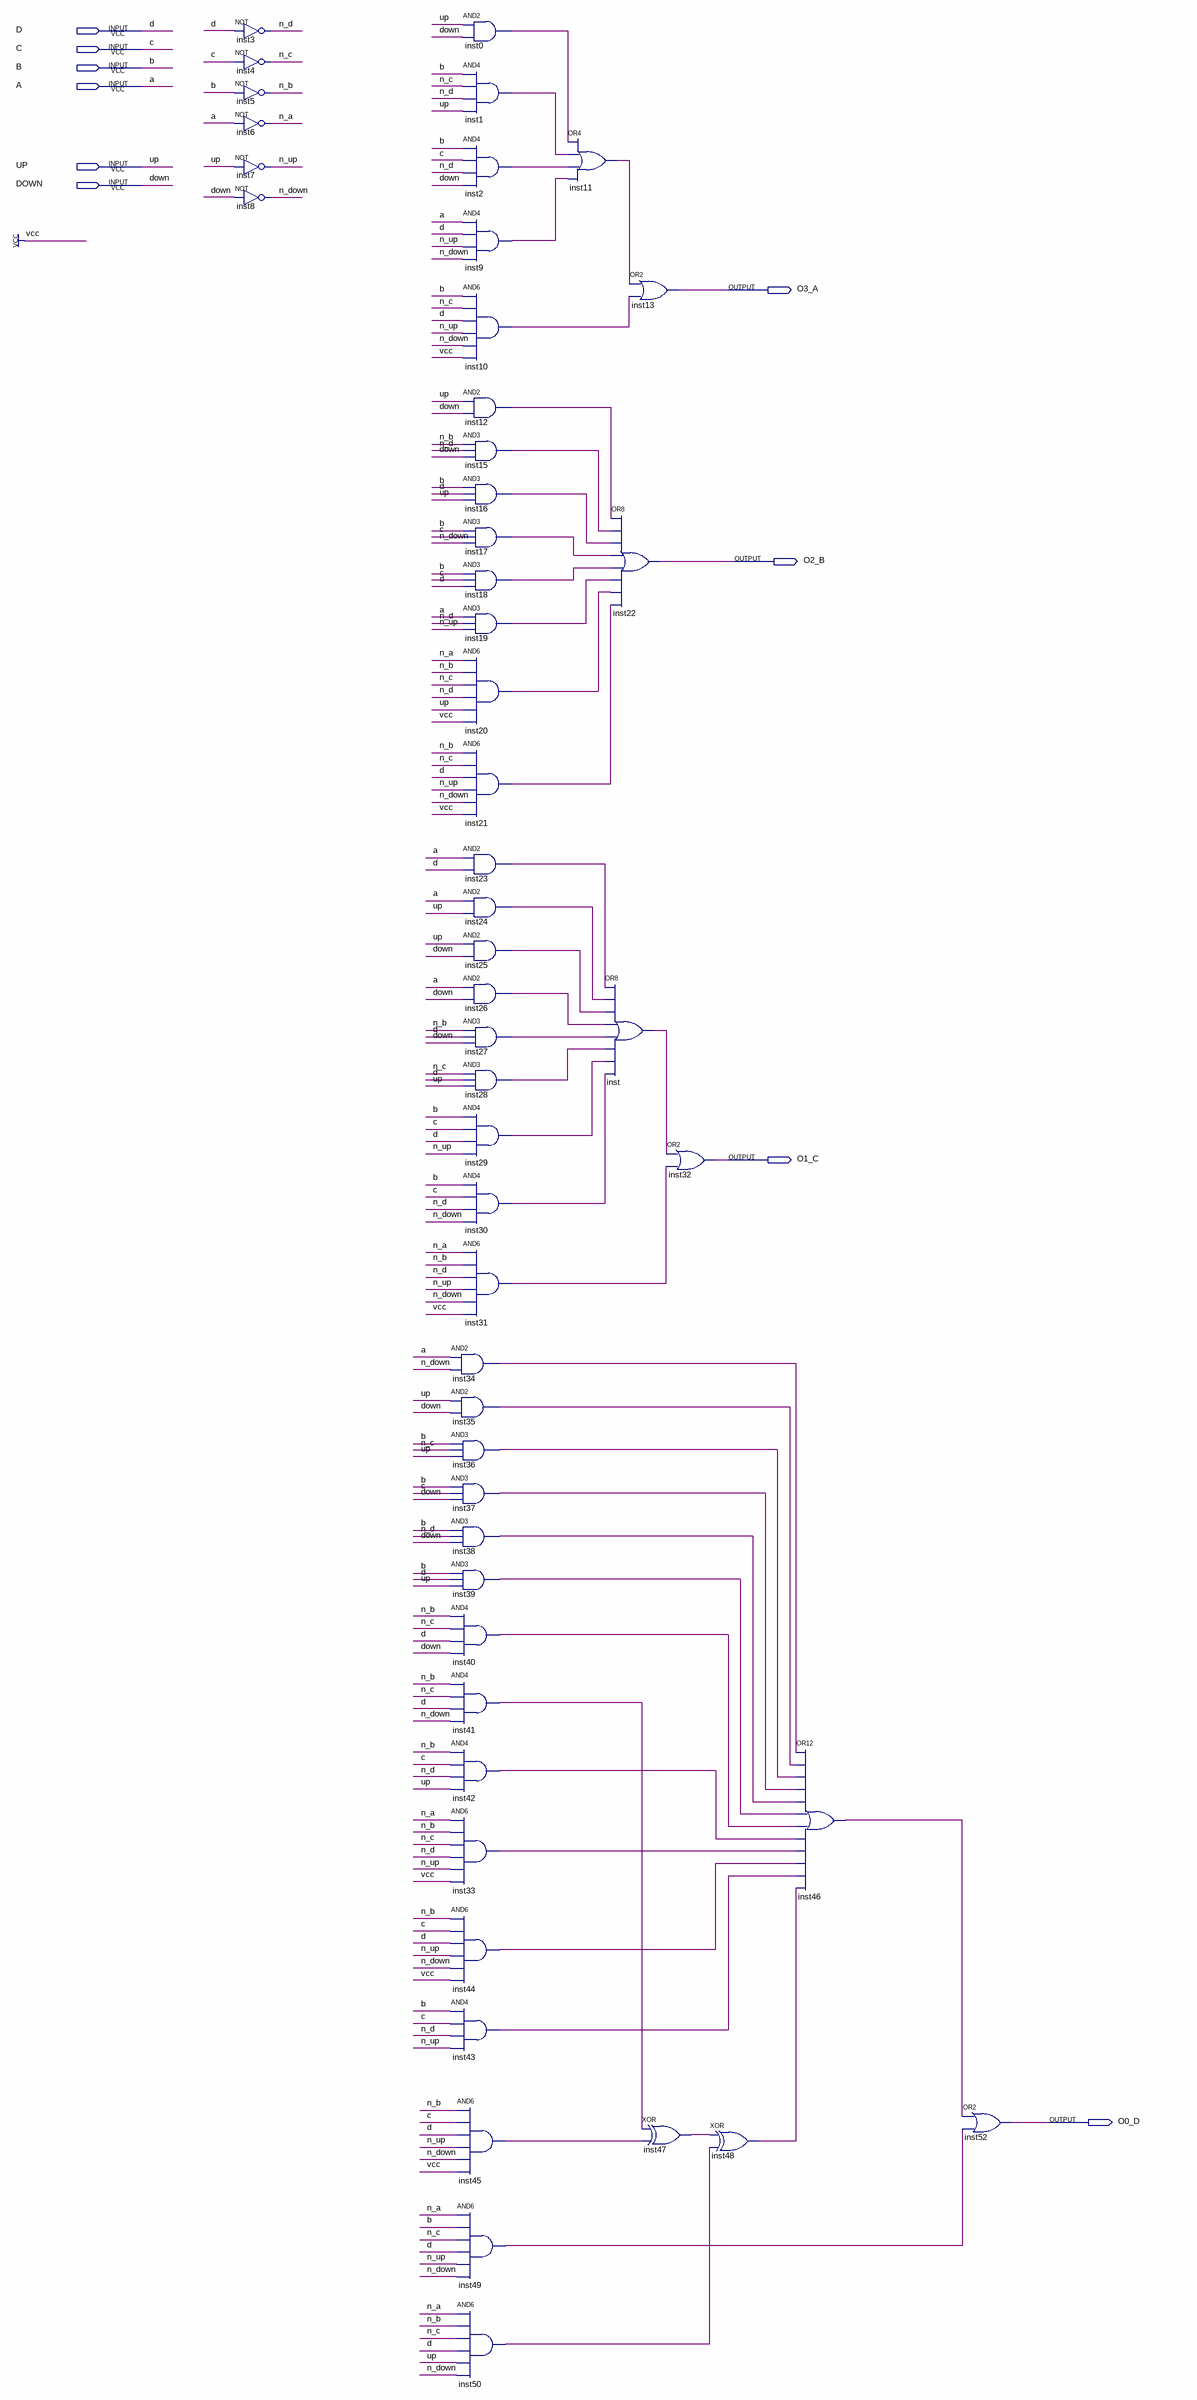
[diagram p0: schematic sheet]
// Quartus schematic Circuito_Combinacional_SAIDA.bdf as structural Verilog: 52 symbols, 10 pins
module Circuito_Combinacional_SAIDA (
  input  D,
  input  C,
  input  B,
  input  A,
  input  UP,
  input  DOWN,
  output O3_A,
  output O2_B,
  output O1_C,
  output O0_D
);

  wire inst0_out, inst1_out, inst2_out, inst9_out, inst10_out, inst11_out, inst12_out, inst15_out,
       inst16_out, inst17_out, inst18_out, inst19_out, inst20_out, inst21_out, inst23_out, inst24_out,
       inst25_out, inst26_out, inst27_out, inst28_out, inst29_out, inst30_out, inst31_out, inst33_out,
       inst34_out, inst35_out, inst36_out, inst37_out, inst38_out, inst39_out, inst40_out, inst41_out,
       inst42_out, inst43_out, inst44_out, inst45_out, inst46_out, inst47_out, inst48_out, inst49_out,
       inst50_out, inst_out, n_a, n_b, n_c, n_d, n_down, n_up;

  not inst3 (n_d, D);
  not inst4 (n_c, C);
  not inst5 (n_b, B);
  not inst6 (n_a, A);
  not inst7 (n_up, UP);
  not inst8 (n_down, DOWN);
  and inst0 (inst0_out, UP, DOWN);
  and inst1 (inst1_out, B, n_c, n_d, UP);
  and inst2 (inst2_out, B, C, n_d, DOWN);
  and inst9 (inst9_out, A, D, n_up, n_down);
  and inst10 (inst10_out, B, n_c, D, n_up, n_down, 1'b1);
  and inst12 (inst12_out, UP, DOWN);
  and inst15 (inst15_out, n_b, n_d, DOWN);
  and inst16 (inst16_out, B, D, UP);
  and inst17 (inst17_out, B, C, n_down);
  and inst18 (inst18_out, B, C, D);
  and inst19 (inst19_out, A, n_d, n_up);
  and inst20 (inst20_out, n_a, n_b, n_c, n_d, UP, 1'b1);
  and inst21 (inst21_out, n_b, n_c, D, n_up, n_down, 1'b1);
  and inst23 (inst23_out, A, D);
  and inst24 (inst24_out, A, UP);
  and inst25 (inst25_out, UP, DOWN);
  and inst26 (inst26_out, A, DOWN);
  and inst27 (inst27_out, n_b, D, DOWN);
  and inst28 (inst28_out, n_c, D, UP);
  and inst29 (inst29_out, B, C, D, n_up);
  and inst30 (inst30_out, B, C, n_d, n_down);
  and inst31 (inst31_out, n_a, n_b, n_d, n_up, n_down, 1'b1);
  and inst34 (inst34_out, A, n_down);
  and inst35 (inst35_out, UP, DOWN);
  and inst36 (inst36_out, B, n_c, UP);
  and inst37 (inst37_out, B, C, DOWN);
  and inst38 (inst38_out, B, n_d, DOWN);
  and inst39 (inst39_out, B, D, UP);
  and inst40 (inst40_out, n_b, n_c, D, DOWN);
  and inst41 (inst41_out, n_b, n_c, D, n_down);
  and inst42 (inst42_out, n_b, C, n_d, UP);
  and inst33 (inst33_out, n_a, n_b, n_c, n_d, n_up, 1'b1);
  and inst44 (inst44_out, n_b, C, D, n_up, n_down, 1'b1);
  and inst43 (inst43_out, B, C, n_d, n_up);
  and inst45 (inst45_out, n_b, C, D, n_up, n_down, 1'b1);
  and inst49 (inst49_out, n_a, B, n_c, D, n_up, n_down);
  and inst50 (inst50_out, n_a, n_b, n_c, D, UP, n_down);
  or inst11 (inst11_out, inst0_out, inst1_out, inst2_out, inst9_out);
  or inst13 (O3_A, inst11_out, inst10_out);
  or inst22 (O2_B, inst12_out, inst15_out, inst16_out, inst17_out, inst18_out, inst19_out, inst20_out, inst21_out);
  or inst (inst_out, inst23_out, inst24_out, inst25_out, inst26_out, inst27_out, inst28_out, inst29_out, inst30_out);
  or inst32 (O1_C, inst_out, inst31_out);
  xor inst47 (inst47_out, inst41_out, inst45_out);
  xor inst48 (inst48_out, inst47_out, inst50_out);
  or inst46 (inst46_out, inst34_out, inst35_out, inst36_out, inst37_out, inst38_out, inst39_out, inst40_out, inst42_out, inst33_out, inst44_out, inst43_out, inst48_out);
  or inst52 (O0_D, inst46_out, inst49_out);
endmodule
